# EAGLE design keyboard (EAGLE 7.6.0)
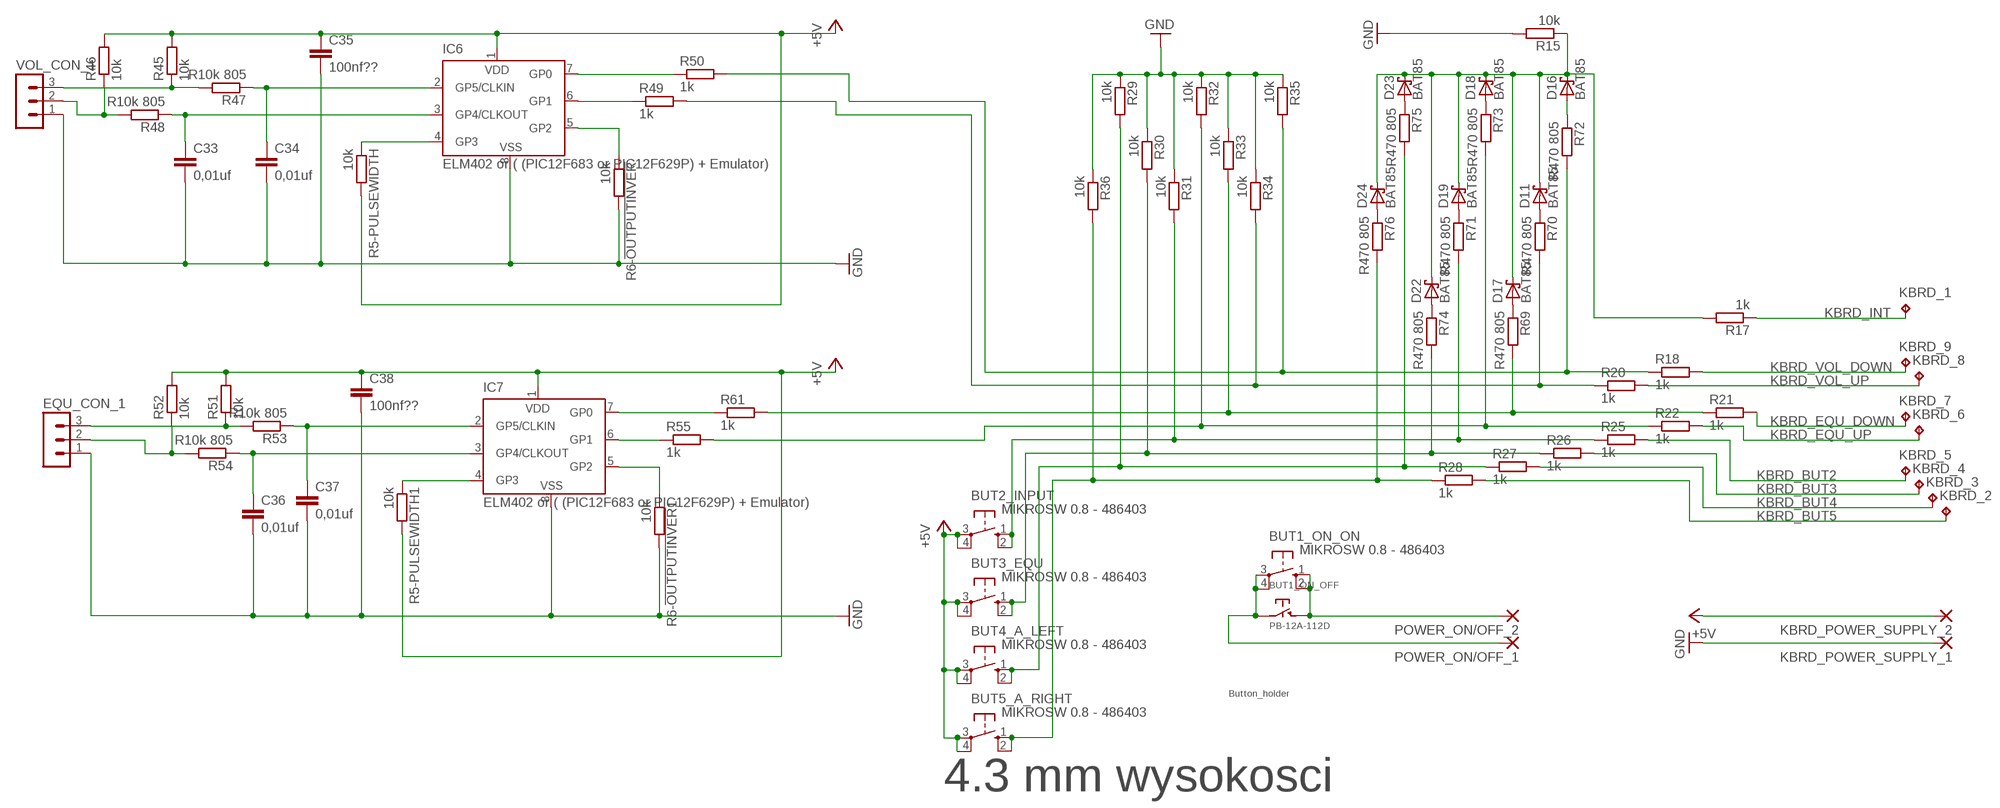
[diagram p0: schematic, sheet 1]

## Parts
BUT1_ON_OFF  PB-12A-112D  [PB-12A-112D]
BUT1_ON_ON  MIKROSW 0.8 - 486403  10-XX  [B3F-10XX]
BUT2_INPUT  MIKROSW 0.8 - 486403  10-XX  [B3F-10XX]
BUT3_EQU  MIKROSW 0.8 - 486403  10-XX  [B3F-10XX]
BUT4_A_LEFT  MIKROSW 0.8 - 486403  10-XX  [B3F-10XX]
BUT5_A_RIGHT  MIKROSW 0.8 - 486403  10-XX  [B3F-10XX]
C33  0,01uf  C-EUC0805  [C0805]
C34  0,01uf  C-EUC0805  [C0805]
C35  100nf??  C-EUC0805  [C0805]
C36  0,01uf  C-EUC0805  [C0805]
C37  0,01uf  C-EUC0805  [C0805]
C38  100nf??  C-EUC0805  [C0805]
D11  BAT85  BAT85DO34-5  [DO34-5]
D16  BAT85  BAT85DO34-5  [DO34-5]
D17  BAT85  BAT85DO34-5  [DO34-5]
D18  BAT85  BAT85DO34-5  [DO34-5]
D19  BAT85  BAT85DO34-5  [DO34-5]
D22  BAT85  BAT85DO34-5  [DO34-5]
D23  BAT85  BAT85DO34-5  [DO34-5]
D24  BAT85  BAT85DO34-5  [DO34-5]
EQU_CON_1  MA03-1  [MA03-1]
IC6  ELM402 or ( (PIC12F683 or PIC12F629P) + Emulator)  PIC12F629P  [DIL8]
IC7  ELM402 or ( (PIC12F683 or PIC12F629P) + Emulator)  PIC12F629P  [DIL8]
KBRD_1  TPPAD1-13Y  [P1-13Y]
KBRD_2  TPPAD1-13Y  [P1-13Y]
KBRD_3  TPPAD1-13Y  [P1-13Y]
KBRD_4  TPPAD1-13Y  [P1-13Y]
KBRD_5  TPPAD1-13Y  [P1-13Y]
KBRD_6  TPPAD1-13Y  [P1-13Y]
KBRD_7  TPPAD1-13Y  [P1-13Y]
KBRD_8  TPPAD1-13Y  [P1-13Y]
KBRD_9  TPPAD1-13Y  [P1-13Y]
KBRD_POWER_SUPPLY_1  1,6/0,9  [1,6/0,9]
KBRD_POWER_SUPPLY_2  1,6/0,9  [1,6/0,9]
POWER_ON/OFF_1  2,15/1,0  [2,15/1,0]
POWER_ON/OFF_2  2,15/1,0  [2,15/1,0]
R5-PULSEWIDTH  10k  R-EU_0204/7  [0204/7]
R5-PULSEWIDTH1  10k  R-EU_0204/7  [0204/7]
R6-!OUTPUTINVER!  10k  R-EU_R0805  [R0805]
R6-!OUTPUTINVER!1  10k  R-EU_R0805  [R0805]
R15  10k  R-EU_R0805  [R0805]
R17  1k  R-EU_R0805  [R0805]
R18  1k  R-EU_R0805  [R0805]
R20  1k  R-EU_R0805  [R0805]
R21  1k  R-EU_R0805  [R0805]
R22  1k  R-EU_R0805  [R0805]
R25  1k  R-EU_R0805  [R0805]
R26  1k  R-EU_R0805  [R0805]
R27  1k  R-EU_R0805  [R0805]
R28  1k  R-EU_R0805  [R0805]
R29  10k  R-EU_R0805  [R0805]
R30  10k  R-EU_R0805  [R0805]
R31  10k  R-EU_M0805  [M0805]
R32  10k  R-EU_0204/5  [0204/5]
R33  10k  R-EU_0204/5  [0204/5]
R34  10k  R-EU_0204/5  [0204/5]
R35  10k  R-EU_0204/5  [0204/5]
R36  10k  R-EU_R0805  [R0805]
R45  10k  R-EU_R0805  [R0805]
R46  10k  R-EU_R0805  [R0805]
R47  R10k 805  R-EU_R0805  [R0805]
R48  R10k 805  R-EU_R0805  [R0805]
R49  1k  R-EU_R0805  [R0805]
R50  1k  R-EU_R0805  [R0805]
R51  10k  R-EU_M0805  [M0805]
R52  10k  R-EU_M0805  [M0805]
R53  R10k 805  R-EU_R0805  [R0805]
R54  R10k 805  R-EU_R0805  [R0805]
R55  1k  R-EU_R0805  [R0805]
R61  1k  R-EU_R0805  [R0805]
R69  R470 805  R-EU_R0805  [R0805]
R70  R470 805  R-EU_R0805  [R0805]
R71  R470 805  R-EU_R0805  [R0805]
R72  R470 805  R-EU_R0805  [R0805]
R73  R470 805  R-EU_R0805  [R0805]
R74  R470 805  R-EU_R0805  [R0805]
R75  R470 805  R-EU_R0805  [R0805]
R76  R470 805  R-EU_R0805  [R0805]
U$1  TRZYMADLO  [TRZYMADLO_POPYCHACZY]
VOL_CON_1  MA03-1  [MA03-1]

## Nets
+5V: BUT2_INPUT.3(P) BUT2_INPUT.4(P1) BUT3_EQU.3(P) BUT3_EQU.4(P1) BUT4_A_LEFT.3(P) BUT4_A_LEFT.4(P1) BUT5_A_RIGHT.3(P) BUT5_A_RIGHT.4(P1) C35.1 C38.1 IC6.1(VDD) IC7.1(VDD) KBRD_POWER_SUPPLY_2.1(P) R5-PULSEWIDTH1.2 R5-PULSEWIDTH.2 R45.2 R46.2 R51.2 R52.2
GND: C33.2 C34.2 C35.2 C36.2 C37.2 C38.2 EQU_CON_1.1 IC6.8(VSS) IC7.8(VSS) KBRD_POWER_SUPPLY_1.1(P) R6-!OUTPUTINVER!1.2 R6-!OUTPUTINVER!.2 R15.2 R29.1 R30.1 R31.1 R32.1 R33.1 R34.1 R35.1 R36.1 VOL_CON_1.1
KBRD_BUT2: KBRD_5.TP R25.2
KBRD_BUT3: KBRD_4.TP R26.2
KBRD_BUT4: KBRD_3.TP R27.2
KBRD_BUT5: KBRD_2.TP R28.2
KBRD_EQU_DOWN: KBRD_7.TP R21.2
KBRD_EQU_UP: KBRD_6.TP R22.2
KBRD_INT: KBRD_1.TP R17.1
KBRD_VOL_DOWN: KBRD_9.TP R18.2
KBRD_VOL_UP: KBRD_8.TP R20.2
N$1: R20.1 R34.2 R49.2 R70.2
N$2: R18.1 R35.2 R50.2 R72.2
N$3: R22.1 R32.2 R55.2 R73.2
N$4: R21.1 R33.2 R61.2 R69.2
N$5: R46.1 R48.2 VOL_CON_1.2
N$6: R45.1 R47.2 VOL_CON_1.3
N$7: BUT1_ON_OFF.P$1 BUT1_ON_ON.3(P) BUT1_ON_ON.4(P1) POWER_ON/OFF_1.1(P)
N$9: BUT1_ON_OFF.P$2 BUT1_ON_ON.1(S) BUT1_ON_ON.2(S1) POWER_ON/OFF_2.1(P)
N$10: EQU_CON_1.2 R52.1 R54.2
N$11: EQU_CON_1.3 R51.1 R53.2
N$20: BUT2_INPUT.1(S) BUT2_INPUT.2(S1) R25.1 R31.2 R71.2
N$21: BUT3_EQU.1(S) BUT3_EQU.2(S1) R26.1 R30.2 R74.2
N$22: BUT4_A_LEFT.1(S) BUT4_A_LEFT.2(S1) R27.1 R29.2 R75.2
N$23: BUT5_A_RIGHT.1(S) BUT5_A_RIGHT.2(S1) R28.1 R36.2 R76.2
N$45: C34.1 IC6.2(GP5/CLKIN) R47.1
N$46: C33.1 IC6.3(GP4/CLKOUT) R48.1
N$47: IC6.4(GP3) R5-PULSEWIDTH.1
N$48: IC6.5(GP2) R6-!OUTPUTINVER!.1
N$49: IC6.6(GP1) R49.1
N$50: IC6.7(GP0) R50.1
N$54: C37.1 IC7.2(GP5/CLKIN) R53.1
N$55: C36.1 IC7.3(GP4/CLKOUT) R54.1
N$56: IC7.4(GP3) R5-PULSEWIDTH1.1
N$57: IC7.5(GP2) R6-!OUTPUTINVER!1.1
N$58: IC7.6(GP1) R55.1
N$59: IC7.7(GP0) R61.1
N$69: D17.A R69.1
N$70: D11.A R70.1
N$71: D18.A R73.1
N$72: D19.A R71.1
N$73: D22.A R74.1
N$74: D23.A R75.1
N$75: D24.A R76.1
N$79: D11.C D16.C D17.C D18.C D19.C D22.C D23.C D24.C R15.1 R17.2
N$80: D16.A R72.1

## Notes on the sheet
- 4.3 mm wysokosci

## Library data of the parts
BUT1_ON_OFF = PB-12A-112D:PB-12A-112D: Bistable (ON-OFF) switch; OC_FARNELL: unknown
BUT1_ON_ON BUT2_INPUT BUT3_EQU BUT4_A_LEFT BUT5_A_RIGHT = switch-omron:10-XX: OMRON SWITCH; MF: OMRON ELECTRONIC COMPONENTS; MPN: B3F-1000; OC_FARNELL: 176432; OC_NEWARK: 36M3542
C33-C38 = rcl:C-EU: CAPACITOR, European symbol; OC_FARNELL: unknown
D11 D16-D19 D22-D24 = diode_SileliS:BAT85; OC_FARNELL: unknown
EQU_CON_1 VOL_CON_1 = con-lstb:MA03-1: PIN HEADER; OC_FARNELL: unknown; OC_NEWARK: unknown
IC6 IC7 = microchip:PIC12F6*: Data Sheet 8-Pin FLASH-Based 8-Bit CMOS Microcontrollers Source: http://www.microchip.com .. 41190c.pdf; MF: MICROCHIP; MPN: PIC12F629-E/P; OC_FARNELL: 1292253; OC_NEWARK: 67K0822
KBRD_1-KBRD_9 = testpad:TP: Test pad
KBRD_POWER_SUPPLY_1 KBRD_POWER_SUPPLY_2 = wirepad:1,6/0,9: THROUGH-HOLE PAD
POWER_ON/OFF_1 POWER_ON/OFF_2 = wirepad:2,15/1,0: THROUGH-HOLE PAD
R5-PULSEWIDTH R5-PULSEWIDTH1 R6-!OUTPUTINVER! R6-!OUTPUTINVER!1 R45-R55 R61 = resistor:R-EU_: RESISTOR, European symbol; OC_FARNELL: unknown
R15 R17 R18 R20-R22 R25-R36 R69-R76 = rcl:R-EU_: RESISTOR, European symbol; OC_FARNELL: unknown
U$1 = trzymadlo:TRZYMADLO; OC_FARNELL: unknown

## Board
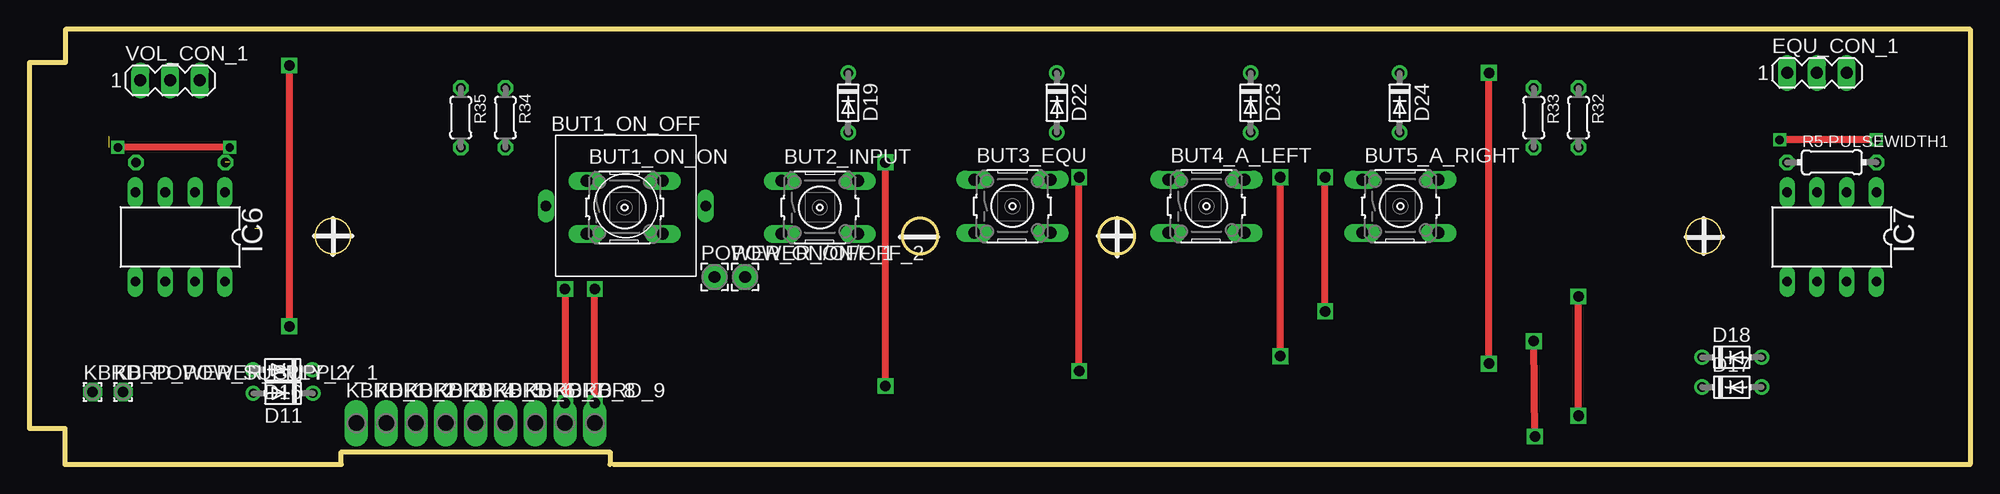
[diagram p1: board, top side]
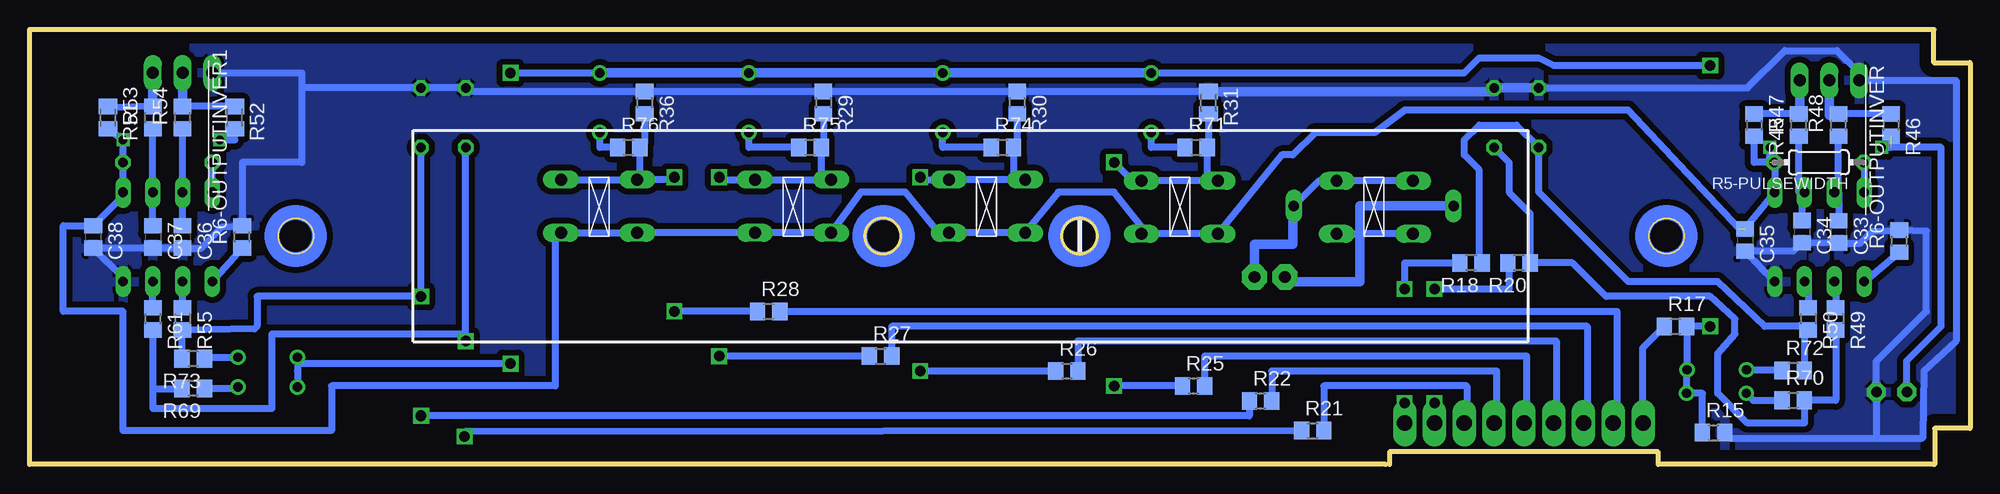
[diagram p2: board, bottom side, seen from below]

Size 165.39 x 37.06 mm. Coordinates in mm from the lower left corner, seen from the top.
Outline: 3.02,0 3.02,3.06 0,3.06 0,34.22 3.09,34.22 3.09,37.06 165.39,37.06 165.39,0 49.79,0
Outline: 49.49,0 49.49,1.06 26.59,1.06 26.59,0 3.09,0
Copper layers (1*16): Top 0.035mm / dielectric 1.5mm / Bottom 0.035mm
Design rules "default": minimum track width 10mil, minimum drill 24mil, track to track 8mil, track to pad 8mil, pad to pad 8mil, via to via 8mil, smd to smd 8mil, copper to edge 40mil, drill to drill 8mil, minimum pad ring 10mil, minimum via ring 8mil, stop-mask expansion 4mil, vias tented up to drill 0mil, thermal gap 10mil

### Footprints (pad centres in the part's own frame; a part is rotated, then mirrored left to right if it is on the bottom)
PB-12A-112D = drill 0.9 long: P$1 -6.8,0; P$2 6.8,0
B3F-10XX = drill 1.016 long: 1 -3.251,2.261; 2 3.251,2.261; 3 -3.251,-2.261; 4 3.251,-2.261
C0805 = smd 1.3 x 1.5: 1 -0.95,0; 2 0.95,0
DO34-5 = drill 0.8: A 2.54,0; C -2.54,0
MA03-1 = drill 1.016 long: 1 -2.54,0; 2 0,0; 3 2.54,0
DIL8 = drill 0.813 long: 1 -3.81,-3.81; 2 -1.27,-3.81; 3 1.27,-3.81; 4 3.81,-3.81; 5 3.81,3.81; 6 1.27,3.81; 7 -1.27,3.81; 8 -3.81,3.81
P1-13Y = drill 1.321 pad 1.905 long: TP 0,0
1,6/0,9 = drill 0.914 pad 1.6 octagon: 1 0,0
2,15/1,0 = drill 1.016 pad 2.159 octagon: 1 0,0
0204/7 = drill 0.813 octagon: 1 -3.81,0; 2 3.81,0
R0805 = smd 1.3 x 1.5: 1 -0.95,0; 2 0.95,0
M0805 = smd 1.3 x 1.6: 1 -0.95,0; 2 0.95,0
0204/5 = drill 0.813 octagon: 1 -2.54,0; 2 2.54,0

### Placement (x,y rotation side)
BUT1_ON_OFF  50.83,22.02 0 top
BUT1_ON_ON  50.73,21.89 0 top
BUT2_INPUT  67.37,21.89 0 top
BUT3_EQU  83.78,21.99 0 top
BUT4_A_LEFT  100.31,21.99 0 top
BUT5_A_RIGHT  116.84,21.99 0 top
C33  11.2,19.8 270 bottom
C34  14.33,19.83 270 bottom
C35  19.2,19.11 270 bottom
C36  152.33,19.38 270 bottom
C37  154.87,19.38 270 bottom
C38  159.95,19.38 270 bottom
D11  21.62,6.06 180 top
D16  21.59,8.06 180 top
D17  145.07,6.58 0 top
D18  145.07,9.12 0 top
D19  69.78,30.81 270 top
D22  87.56,30.81 270 top
D23  104.07,30.81 270 top
D24  116.77,30.81 270 top
EQU_CON_1  152.33,33.35 0 top
IC6  12.85,19.37 180 top
IC7  153.6,19.37 180 top
KBRD_1  27.87,3.5 0 top
KBRD_2  30.41,3.5 0 top
KBRD_3  32.95,3.5 0 top
KBRD_4  35.49,3.5 0 top
KBRD_5  38.03,3.5 0 top
KBRD_6  40.57,3.5 0 top
KBRD_7  43.11,3.5 0 top
KBRD_8  45.65,3.5 0 top
KBRD_9  48.19,3.5 0 top
KBRD_POWER_SUPPLY_1  7.99,6.16 0 top
KBRD_POWER_SUPPLY_2  5.39,6.16 0 top
POWER_ON/OFF_1  58.39,15.96 0 top
POWER_ON/OFF_2  60.99,15.96 0 top
R5-PULSEWIDTH  12.9,25.73 180 bottom
R5-PULSEWIDTH1  153.6,25.73 0 top
R6-!OUTPUTINVER!  6.04,19.01 90 bottom
R6-!OUTPUTINVER!1  147.25,19.38 90 bottom
R15  21.86,2.7 0 bottom
R17  25.11,11.76 0 bottom
R18  42.53,17.16 180 bottom
R20  38.45,17.16 180 bottom
R21  56.02,2.87 0 bottom
R22  60.47,5.41 0 bottom
R25  66.19,6.68 0 bottom
R26  76.98,7.95 0 bottom
R27  92.85,9.22 0 bottom
R28  102.38,13.03 0 bottom
R29  97.72,30.81 270 bottom
R30  81.21,30.81 270 bottom
R31  64.9,30.81 270 bottom
R32  132.01,29.54 270 top
R33  128.2,29.54 270 top
R34  40.57,29.54 270 top
R35  36.76,29.54 270 top
R36  112.96,30.81 270 bottom
R45  18.41,28.9 270 bottom
R46  6.75,28.9 270 bottom
R47  14.6,28.9 90 bottom
R48  11.22,28.9 90 bottom
R49  11.46,12.39 270 bottom
R50  13.81,12.39 270 bottom
R51  158.68,29.54 270 bottom
R52  147.88,29.54 270 bottom
R53  154.87,29.54 90 bottom
R54  152.33,29.54 90 bottom
R55  152.33,12.39 270 bottom
R61  154.87,12.39 270 bottom
R69  151.42,6.46 180 bottom
R70  15.07,5.46 0 bottom
R71  65.97,27 0 bottom
R72  15.07,8 0 bottom
R73  151.42,9 180 bottom
R74  82.48,27 0 bottom
R75  98.86,27 0 bottom
R76  114.32,27 0 bottom
U$1  132.67,10.45 0 bottom
VOL_CON_1  11.99,32.72 0 top

### Tracks (layer width: path | path; a pad name or v marks a point on that pad's centre or on a via)
+5V  (via drill 0.7)  (3 unrouted)
  Top 0.61: v157.41,27.64 v149.16,27.64 | v17.07,27 v7.55,27
  Bottom 0.61: C35.1 IC6.1 16.66,25.73 R5-PULSEWIDTH.2 18.41,25.73 R45.2 | R51.2 v157.41,27.64 R5-PULSEWIDTH1.2 IC7.1 157.41,22.87 C38.1 162.49,20.33 162.49,13.03 157.41,13.03 157.41,2.87 139.63,2.87 139.63,6.68 120.58,6.68 120.58,19.73 BUT5_A_RIGHT.4 BUT5_A_RIGHT.3 BUT4_A_LEFT.4 BUT4_A_LEFT.3 94.54,23.19 90.73,23.19 87.91,19.73 BUT3_EQU.4 BUT3_EQU.3 77.7,23.19 72.95,23.19 70.62,20.22 BUT2_INPUT.4 BUT2_INPUT.3 58.65,26.36 57.71,26.36 55.81,28.27 50.73,28.27 48.19,30.18 29.14,30.18 19.66,20.06 | v149.16,27.64 147.88,27.64 R52.2 | 17.07,25.73 v17.07,27 | 6.75,27 v7.55,27 2.47,27 2.47,11.76 5.41,8.82 arc90 5.39,8.8 KBRD_POWER_SUPPLY_2.1
GND
  Bottom 0.61: R31.1 R30.1 R29.1 R36.1 128.2,31.76 R33.1 R32.1 142.17,32.08 | IC6.8 C35.2 15.06,18.15 C34.2 C33.2 9.35,18.85 8.34,19.86 R6-!OUTPUTINVER!.2 3.74,19.86 3.74,13.03 7.95,8.82 7.99,8.82 KBRD_POWER_SUPPLY_1.1 7.99,2.23 | IC7.8 157.41,15.89 C38.2 C37.2 C36.2 150.74,18.43 148.94,20.23 R6-!OUTPUTINVER!1.2 147.25,25.73 142.17,25.73 142.17,32.08 | EQU_CON_1.1 142.17,33.35 142.17,32.08 | R15.2 20.45,2.23 7.99,2.23 | 7.99,2.23 4.04,2.23 3.94,7.95 1.2,10.49 1.2,32.72 VOL_CON_1.1 9.45,33.35 11.36,35.25 15.8,35.25 18.98,32.08 R35.1
  Bottom 0.813: R35.1 R34.1 40.57,31.76 R31.1
  pour Bottom (isolate 0.508): -2.61,-2.21 170.11,-3.48 170.11,39.7 -2.61,40.97
KBRD_BUT2
  Bottom 0.61: R25.2 65.23,9.22 37.81,9.22 37.81,3.72 KBRD_5.TP
KBRD_BUT3
  Bottom 0.61: R26.2 76.03,10.49 35.27,10.49 35.27,3.72 KBRD_4.TP
KBRD_BUT4
  Bottom 0.61: R27.2 91.91,11.76 32.63,11.76 32.63,3.82 KBRD_3.TP
KBRD_BUT5
  Bottom 0.61: R28.2 30.09,13.03 30.09,3.5 KBRD_2.TP
KBRD_EQU_DOWN
  Bottom 0.61: R21.2 55.07,6.68 42.89,6.68 42.89,3.72 KBRD_7.TP
KBRD_EQU_UP
  Bottom 0.61: R22.2 59.52,7.95 40.36,7.95 40.36,3.72 KBRD_6.TP
KBRD_INT
  Bottom 0.61: R17.1 27.92,9.9 27.92,3.5 KBRD_1.TP
KBRD_VOL_DOWN  (via drill 0.9)
  Top 0.61: v48.19,5.21 v48.19,14.93
  Bottom 0.61: v48.19,14.93 48.19,17.16 R18.2 | v48.19,5.21 KBRD_9.TP
KBRD_VOL_UP  (via drill 0.9)
  Top 0.61: v45.65,14.93 v45.65,5.21
  Bottom 0.61: R20.2 39.3,17.06 39.3,14.93 v45.65,14.93 | v45.65,5.21 KBRD_8.TP
N$1
  Bottom 0.61: R34.2 39.3,25.73 39.3,23.19 37.5,21.39 R20.1 33.91,17.16 31.05,14.3 22.15,14.3 20.05,12.39 20.05,11.13 21.52,9.46 21.52,6.04 18.98,3.5 14.12,3.5 R70.2 11.46,5.46 R49.2
N$2
  Bottom 0.61: R50.2 14.12,11.54 | 14.12,11.54 R72.2 | R18.1 41.84,17.16 41.84,25.1 43.11,26.36 43.11,27.64 41.84,28.9 38.66,28.9 R35.2 36.76,23.19 29.14,15.57 21.52,15.57 17.51,11.76 14.12,11.76 14.12,11.54
N$3  (via drill 0.9)
  Top 0.61: v132.01,4.14 v132.01,14.3
  Bottom 0.61: R73.2 152.38,11.54 R55.2 146.19,11.54 145.98,11.76 145.98,14.3 v132.01,14.3 R32.2 | R22.1 61.42,4.14 v132.01,4.14
N$4  (via drill 0.9)
  Top 0.61: v128.3,2.37 v128.2,10.49
  Bottom 0.61: R69.2 154.87,6.46 R61.2 154.87,4.77 144.71,4.77 144.71,11.13 128.2,11.13 | 128.2,11.13 R33.2 | R21.1 128.29,2.76 v128.29,2.37 v128.3,2.37 | v128.2,10.49 128.2,11.13
N$5
  Bottom 0.61: R46.1 R48.2
  Bottom 0.813: R48.2 11.99,29.75 VOL_CON_1.2
N$6
  Bottom 0.61: R47.2 R45.1
  Bottom 0.813: R47.2 14.53,29.75 VOL_CON_1.3
N$7
  Bottom 0.61: BUT1_ON_ON.3 51.75,19.63 52,19.38 52.25,19.63 BUT1_ON_ON.4
  Bottom 0.813: BUT1_ON_OFF.P$1 52,22.02 52,19.38 52,15.57 58.39,15.57 POWER_ON/OFF_1.1
N$9
  Bottom 0.61: BUT1_ON_ON.1 BUT1_ON_ON.2 55.5,24.15 BUT1_ON_OFF.P$2
  Bottom 0.813: BUT1_ON_OFF.P$2 57.71,22.02 57.71,18.75 60.99,18.75 POWER_ON/OFF_2.1
N$10
  Bottom 0.61: R52.1 R54.2
  Bottom 0.813: R54.2 EQU_CON_1.2
N$11
  Bottom 0.61: R53.2 158.68,30.39 R51.1
  Bottom 0.813: R53.2 EQU_CON_1.3
N$20  (via drill 0.9)
  Top 0.61: v72.95,6.68 v72.95,25.73
  Bottom 0.61: R31.2 64.9,27.12 R71.2 65.02,24.15 | BUT2_INPUT.1 65.02,24.15 | 65.02,24.15 BUT2_INPUT.2 71.38,24.15 v72.95,25.73 | R25.1 v72.95,6.68
N$21  (via drill 0.9)
  Top 0.61: v89.47,7.95 v89.47,24.46
  Bottom 0.61: R30.2 81.21,27.32 R74.2 81.53,24.25 | BUT3_EQU.1 81.53,24.25 | 81.53,24.25 BUT3_EQU.2 89.26,24.25 v89.47,24.46 | R26.1 v89.47,7.95
N$22  (via drill 0.9)
  Top 0.61: v106.61,9.22 v106.61,24.46
  Bottom 0.61: R29.2 97.72,27.19 R75.2 97.91,24.25 | 97.91,24.25 BUT4_A_LEFT.2 106.61,24.25 v106.61,24.46 | 97.91,24.25 BUT4_A_LEFT.1 | R27.1 v106.61,9.22
N$23  (via drill 0.9)
  Top 0.61: v110.42,13.03 v110.42,24.46
  Bottom 0.61: R36.2 112.96,27.41 R76.2 113.37,24.25 BUT5_A_RIGHT.1 | BUT5_A_RIGHT.2 BUT5_A_RIGHT.1 | R28.1 v110.42,13.03 | v110.42,24.46 110.42,24.25 BUT5_A_RIGHT.1
N$45
  Bottom 0.61: C34.1 14.33,22.96 IC6.2 14.6,23.18 R47.1
N$46
  Bottom 0.61: C33.1 11.2,23.18 IC6.3 11.22,23.18 R48.1
N$47
  Bottom 0.61: R5-PULSEWIDTH.1 9.04,25.73 IC6.4
N$48
  Bottom 0.61: R6-!OUTPUTINVER!.1 IC6.5
N$49
  Bottom 0.61: IC6.6 11.46,15.56 R49.1
N$50
  Bottom 0.61: IC6.7 13.81,15.56 R50.1
N$54
  Bottom 0.61: IC7.2 C37.1 R53.1
N$55
  Bottom 0.61: C36.1 IC7.3 R54.1
N$56
  Bottom 0.61: IC7.4 R5-PULSEWIDTH1.1
N$57
  Bottom 0.61: R6-!OUTPUTINVER!1.1 IC7.5
N$58
  Bottom 0.61: R55.1 IC7.6
N$59
  Bottom 0.61: R61.1 IC7.7
N$69
  Bottom 0.61: D17.A 147.61,6.46 R69.1
N$70
  Bottom 0.61: D11.A 18.48,5.46 R70.1
N$71
  Bottom 0.61: R73.1 150.47,9.12 D18.A
N$72
  Bottom 0.61: R71.1 69.78,27 D19.A
N$73
  Bottom 0.61: R74.1 87.56,27 D22.A
N$74
  Bottom 0.61: R75.1 104.07,27 D23.A
N$75
  Bottom 0.61: R76.1 116.77,27 D24.A
N$79  (via drill 0.9)
  Top 0.61: v124.39,8.58 v124.39,33.35 | v22.15,33.98 v22.15,11.76
  Bottom 0.61: D18.C D17.C | D18.C 142.53,7.95 | v124.39,33.35 D24.C | v124.39,8.58 142.53,8.58 D18.C | R15.1 22.81,6.06 D11.C 24.13,6.08 D16.C R17.2 v22.15,11.76 | D19.C 43.11,33.35 41.84,34.62 36.76,34.62 35.49,33.98 v22.15,33.98
  Bottom 0.813: D19.C D22.C D23.C D24.C
N$80
  Bottom 0.61: R72.1 19.05,8 D16.A
(copper drawn outside any net)
  shapes: Bottom circle x4